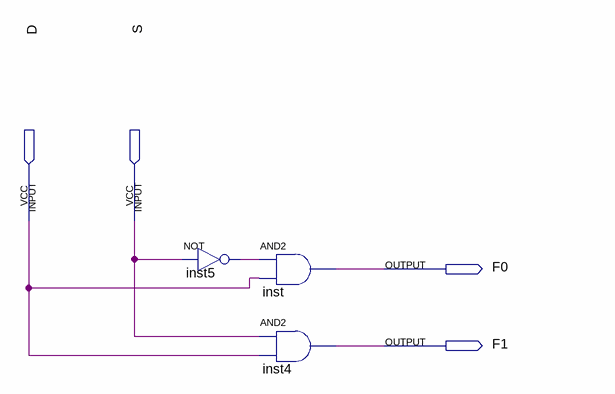
[diagram p0: schematic sheet]
// Quartus schematic No5.bdf as structural Verilog: 3 symbols, 4 pins
module No5 (
  input  D,
  input  S,
  output F0,
  output F1
);

  wire inst5_out;

  not inst5 (inst5_out, S);
  and inst (F0, inst5_out, D);
  and inst4 (F1, S, D);
endmodule
